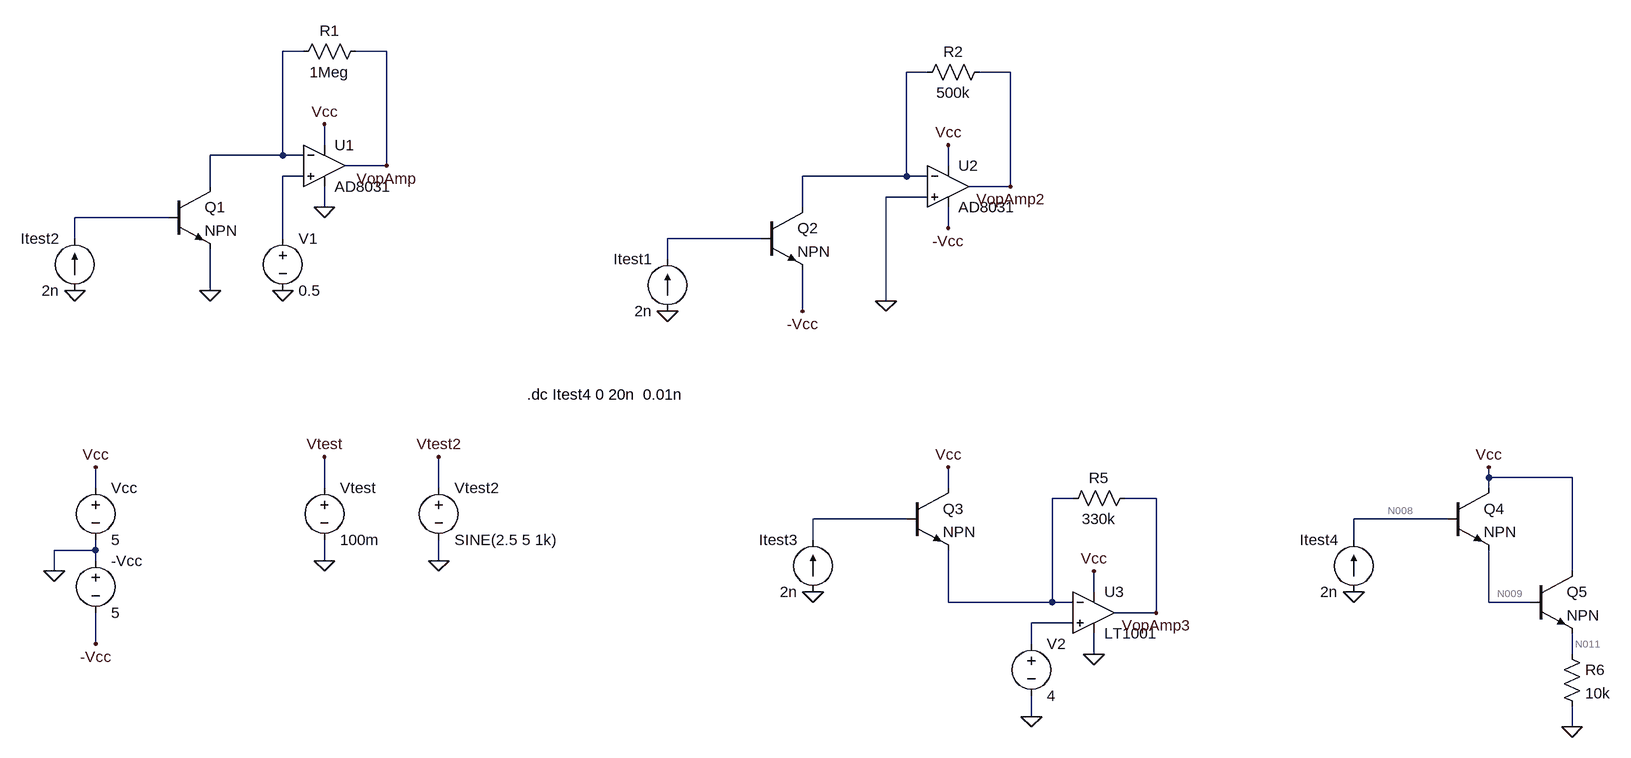
[diagram p0: schematic test_TransAmpedanceAmplifier.asc]
test_TransAmpedanceAmplifier.asc, the LTspice schematic file:
Version 4
SHEET 1 2368 680
WIRE 336 -432 304 -432
WIRE 464 -432 416 -432
WIRE 1296 -400 1264 -400
WIRE 1424 -400 1376 -400
WIRE 368 -288 368 -320
WIRE 304 -272 304 -432
WIRE 304 -272 192 -272
WIRE 336 -272 304 -272
WIRE 464 -256 464 -432
WIRE 464 -256 400 -256
WIRE 1328 -256 1328 -288
WIRE 336 -240 304 -240
WIRE 1264 -240 1264 -400
WIRE 1264 -240 1104 -240
WIRE 1296 -240 1264 -240
WIRE 192 -224 192 -272
WIRE 1424 -224 1424 -400
WIRE 1424 -224 1360 -224
WIRE 1296 -208 1232 -208
WIRE 368 -192 368 -224
WIRE 1104 -192 1104 -240
WIRE 128 -176 -16 -176
WIRE 1328 -160 1328 -192
WIRE -16 -144 -16 -176
WIRE 304 -144 304 -240
WIRE 1040 -144 896 -144
WIRE 896 -112 896 -144
WIRE 192 -64 192 -128
WIRE 1232 -48 1232 -208
WIRE 1104 -32 1104 -96
WIRE 2160 224 2160 208
WIRE 2288 224 2160 224
WIRE 16 240 16 208
WIRE 368 240 368 192
WIRE 544 240 544 192
WIRE 1328 240 1328 208
WIRE 2160 240 2160 224
WIRE 1520 256 1488 256
WIRE 1648 256 1600 256
WIRE 1264 288 1120 288
WIRE 2096 288 1952 288
WIRE 1120 320 1120 288
WIRE 1952 320 1952 288
WIRE 16 336 16 320
WIRE 16 336 -48 336
WIRE 16 352 16 336
WIRE 368 352 368 320
WIRE 544 352 544 320
WIRE -48 368 -48 336
WIRE 2288 368 2288 224
WIRE 1552 400 1552 368
WIRE 1328 416 1328 336
WIRE 1488 416 1488 256
WIRE 1488 416 1328 416
WIRE 1520 416 1488 416
WIRE 2160 416 2160 336
WIRE 2224 416 2160 416
WIRE 1648 432 1648 256
WIRE 1648 432 1584 432
WIRE 1520 448 1456 448
WIRE 16 480 16 432
WIRE 1456 480 1456 448
WIRE 1552 496 1552 464
WIRE 2288 496 2288 464
WIRE 1456 592 1456 560
WIRE 2288 608 2288 576
FLAG 16 208 Vcc
FLAG 16 480 -Vcc
FLAG -48 368 0
FLAG 368 352 0
FLAG 544 352 0
FLAG 368 192 Vtest
FLAG 544 192 Vtest2
FLAG 368 -320 Vcc
FLAG 368 -192 0
FLAG 464 -256 VopAmp
FLAG 192 -64 0
FLAG 304 -64 0
FLAG 1328 -288 Vcc
FLAG 1424 -224 VopAmp2
FLAG -16 -64 0
FLAG 896 -32 0
FLAG 1232 -48 0
FLAG 1552 368 Vcc
FLAG 1648 432 VopAmp3
FLAG 1120 400 0
FLAG 1328 208 Vcc
FLAG 1952 400 0
FLAG 2160 208 Vcc
FLAG 2288 608 0
FLAG 1552 496 0
FLAG 1456 592 0
FLAG 1104 -32 -Vcc
FLAG 1328 -160 -Vcc
SYMBOL voltage 16 224 R0
WINDOW 123 0 0 Left 0
WINDOW 39 0 0 Left 0
SYMATTR InstName Vcc
SYMATTR Value 5
SYMBOL voltage 16 336 R0
WINDOW 123 0 0 Left 0
WINDOW 39 0 0 Left 0
SYMATTR InstName -Vcc
SYMATTR Value 5
SYMBOL voltage 368 224 R0
WINDOW 123 0 0 Left 0
WINDOW 39 0 0 Left 0
SYMATTR InstName Vtest
SYMATTR Value 100m
SYMBOL voltage 544 224 R0
WINDOW 123 0 0 Left 0
WINDOW 39 0 0 Left 0
SYMATTR InstName Vtest2
SYMATTR Value SINE(2.5 5 1k)
SYMBOL npn 128 -224 R0
SYMATTR InstName Q1
SYMBOL res 432 -448 R90
WINDOW 0 0 56 VBottom 2
WINDOW 3 32 56 VTop 2
SYMATTR InstName R1
SYMATTR Value 1Meg
SYMBOL voltage 304 -160 R0
WINDOW 123 0 0 Left 0
WINDOW 39 0 0 Left 0
SYMATTR InstName V1
SYMATTR Value 0.5
SYMBOL OpAmps\\AD8031 1328 -288 R0
SYMATTR InstName U2
SYMBOL current -16 -64 R180
WINDOW 0 24 80 Left 2
WINDOW 3 24 0 Left 2
WINDOW 123 0 0 Left 0
WINDOW 39 0 0 Left 0
SYMATTR InstName Itest2
SYMATTR Value 2n
SYMBOL npn 1040 -192 R0
SYMATTR InstName Q2
SYMBOL current 896 -32 R180
WINDOW 0 24 80 Left 2
WINDOW 3 24 0 Left 2
WINDOW 123 0 0 Left 0
WINDOW 39 0 0 Left 0
SYMATTR InstName Itest1
SYMATTR Value 2n
SYMBOL res 1392 -416 R90
WINDOW 0 0 56 VBottom 2
WINDOW 3 32 56 VTop 2
SYMATTR InstName R2
SYMATTR Value 500k
SYMBOL npn 1264 240 R0
SYMATTR InstName Q3
SYMBOL current 1120 400 R180
WINDOW 0 24 80 Left 2
WINDOW 3 24 0 Left 2
WINDOW 123 0 0 Left 0
WINDOW 39 0 0 Left 0
SYMATTR InstName Itest3
SYMATTR Value 2n
SYMBOL npn 2096 240 R0
SYMATTR InstName Q4
SYMBOL current 1952 400 R180
WINDOW 0 24 80 Left 2
WINDOW 3 24 0 Left 2
WINDOW 123 0 0 Left 0
WINDOW 39 0 0 Left 0
SYMATTR InstName Itest4
SYMATTR Value 2n
SYMBOL npn 2224 368 R0
SYMATTR InstName Q5
SYMBOL res 2272 480 R0
SYMATTR InstName R6
SYMATTR Value 10k
SYMBOL voltage 1456 464 R0
WINDOW 123 0 0 Left 0
WINDOW 39 0 0 Left 0
SYMATTR InstName V2
SYMATTR Value 4
SYMBOL res 1504 272 R270
WINDOW 0 32 56 VTop 2
WINDOW 3 0 56 VBottom 2
SYMATTR InstName R5
SYMATTR Value 330k
SYMBOL OpAmps\\LT1001 1552 368 R0
SYMATTR InstName U3
SYMBOL OpAmps\\AD8031 368 -320 R0
SYMATTR InstName U1
TEXT 680 96 Left 2 !.dc Itest4 0 20n  0.01n

The netlist it stands for:
* test_TransAmpedanceAmplifier.asc
Vcc Vcc 0 5
V§-Vcc 0 -Vcc 5
Vtest Vtest 0 100m
Vtest2 Vtest2 0 SINE(2.5 5 1k)
Q1 N001 N004 0 0 NPN
R1 VopAmp N001 1Meg
V1 N003 0 0.5
XU2 0 N002 Vcc -Vcc VopAmp2 AD8031  ; pins In+ In- V+ V- OUT
Itest2 0 N004 2n
Q2 N002 N005 -Vcc 0 NPN
Itest1 0 N005 2n
R2 VopAmp2 N002 500k
Q3 Vcc N007 N006 0 NPN
Itest3 0 N007 2n
Q4 Vcc N008 N009 0 NPN
Itest4 0 N008 2n
Q5 Vcc N009 N011 0 NPN
R6 N011 0 10k
V2 N010 0 4
R5 N006 VopAmp3 330k
XU3 N010 N006 Vcc 0 VopAmp3 LT1001  ; pins In+ In- V+ V- OUT
XU1 N003 N001 Vcc 0 VopAmp AD8031  ; pins In+ In- V+ V- OUT
.model NPN NPN
.model PNP PNP
.lib standard.bjt
.dc Itest4 0 20n  0.01n
.lib LTC.lib
.backanno
.end

* Results of the author's LTspice run, read from the files saved beside the schematic
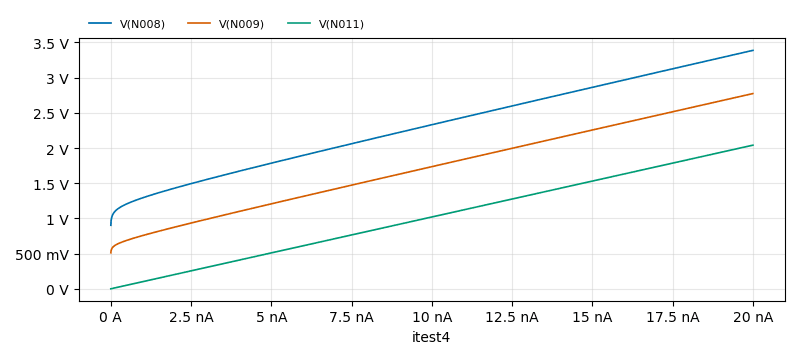
[diagram p1: DC transfer characteristic of test_TransAmpedanceAmplifier.asc, plotted from the saved traces]
* DC transfer characteristic, 1 run:
*   V(N008): 902.5 mV at itest4=0 A, 3.387 V at itest4=20 nA, min 902.5 mV, max 3.387 V
*   V(N009): 511.3 mV at itest4=0 A, 2.773 V at itest4=20 nA, min 511.3 mV, max 2.773 V
*   V(N011): 382.5 µV at itest4=0 A, 2.04 V at itest4=20 nA, min 382.5 µV, max 2.04 V